# Altium schematic sheet PA-HF_100W-VHF_60W.SchDoc
size A4; SheetNumber: 1; SheetTotal: 5
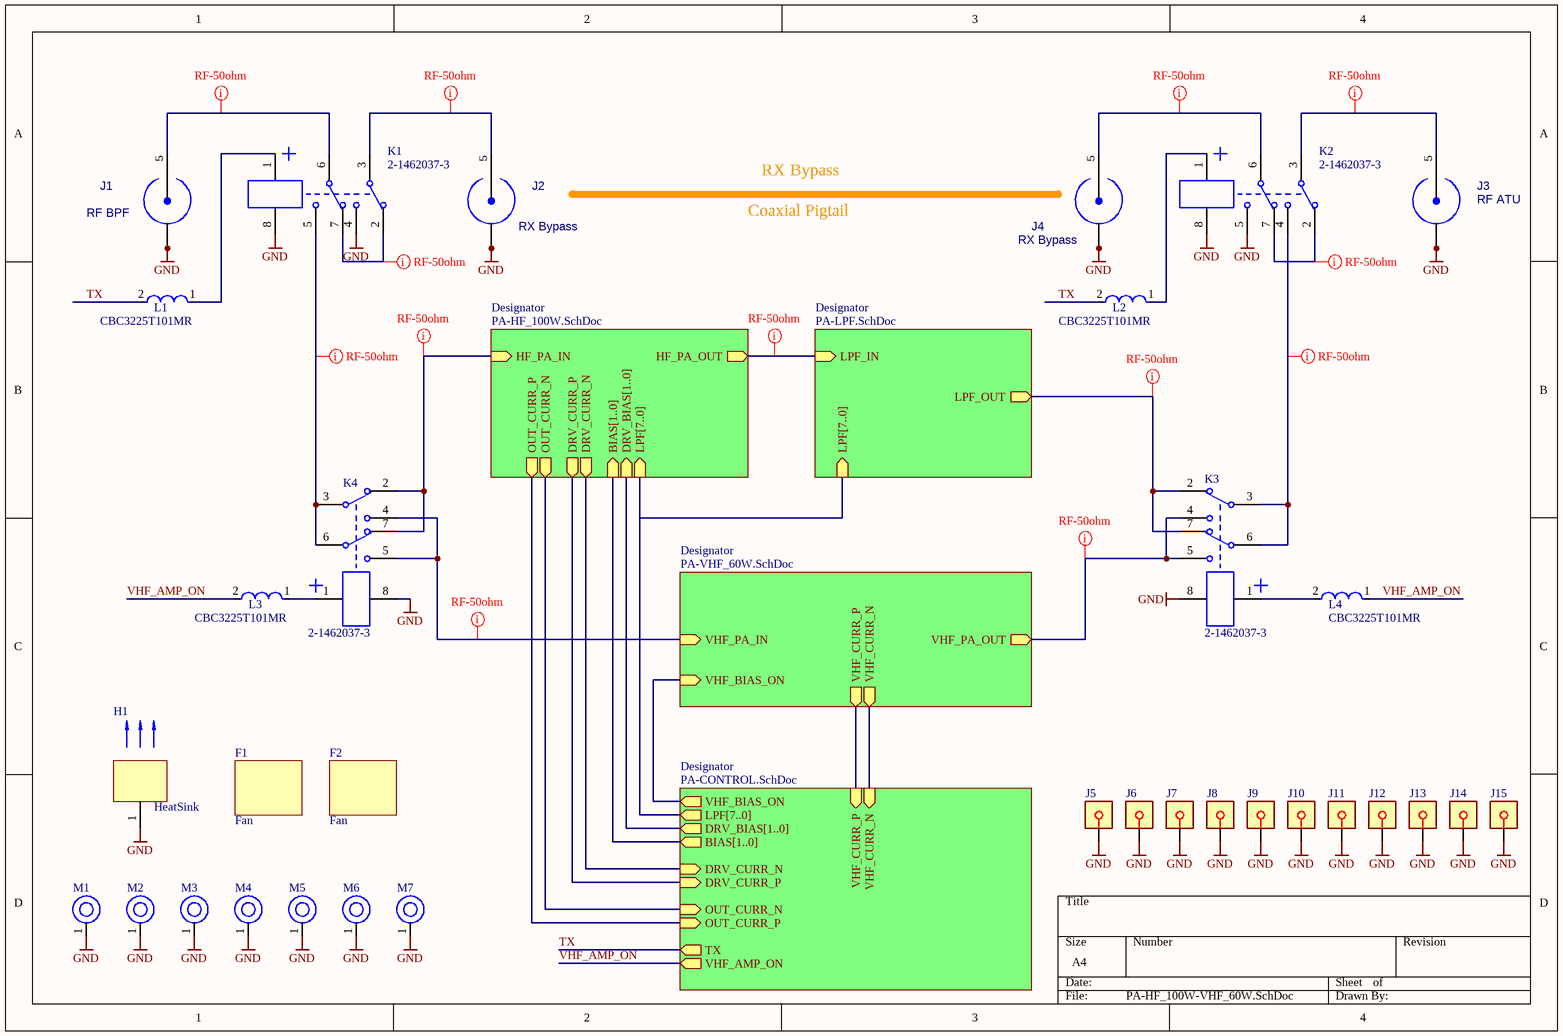
[diagram p0: PA-HF_100W-VHF_60W.SchDoc]

## Parts
F1  Fan  [Fan_60x60x25mm]
F2  Fan  [Fan_60x60x25mm]
H1  HeatSink  [HEATSINK_145x140x35]
J1  RF BPF  [31-5431]
J2  RX Bypass  [31-5431]
J3  RF ATU  [31-5431]
J4  RX Bypass  [31-5431]
J5  SMT RFI Shield Clip  [SMT RFI Shield Clip]  (value not drawn)
J6  SMT RFI Shield Clip  [SMT RFI Shield Clip]  (value not drawn)
J7  SMT RFI Shield Clip  [SMT RFI Shield Clip]  (value not drawn)
J8  SMT RFI Shield Clip  [SMT RFI Shield Clip]  (value not drawn)
J9  SMT RFI Shield Clip  [SMT RFI Shield Clip]  (value not drawn)
J10  SMT RFI Shield Clip  [SMT RFI Shield Clip]  (value not drawn)
J11  SMT RFI Shield Clip  [SMT RFI Shield Clip]  (value not drawn)
J12  SMT RFI Shield Clip  [SMT RFI Shield Clip]  (value not drawn)
J13  SMT RFI Shield Clip  [SMT RFI Shield Clip]  (value not drawn)
J14  SMT RFI Shield Clip  [SMT RFI Shield Clip]  (value not drawn)
J15  SMT RFI Shield Clip  [SMT RFI Shield Clip]  (value not drawn)
K1  2-1462037-3  [TECO-2-1462037-3_V]
K2  2-1462037-3  [TECO-2-1462037-3_V]
K3  2-1462037-3  [TECO-2-1462037-3_V]
K4  2-1462037-3  [TECO-2-1462037-3_V]
L1  CBC3225T101MR  [FP-CB3225-MFG]
L2  CBC3225T101MR  [FP-CB3225-MFG]
L3  CBC3225T101MR  [FP-CB3225-MFG]
L4  CBC3225T101MR  [FP-CB3225-MFG]
M1  MountHole  [MountHole]  (value not drawn)
M2  MountHole  [MountHole]  (value not drawn)
M3  MountHole  [MountHole]  (value not drawn)
M4  MountHole  [MountHole]  (value not drawn)
M5  MountHole  [MountHole]  (value not drawn)
M6  MountHole  [MountHole]  (value not drawn)
M7  MountHole  [MountHole]  (value not drawn)

## Sub-sheets
Designator = PA-CONTROL.SchDoc: LPF[7..0] (out), DRV_BIAS[1..0] (out), BIAS[1..0] (out), DRV_CURR_N (in), DRV_CURR_P (in), OUT_CURR_N (in), OUT_CURR_P (in), VHF_BIAS_ON (out), TX (out), VHF_AMP_ON (out), VHF_CURR_P (in), VHF_CURR_N (in)
Designator = PA-HF_100W.SchDoc: HF_PA_IN (in), HF_PA_OUT (out), DRV_BIAS[1..0] (in), BIAS[1..0] (in), DRV_CURR_N (out), DRV_CURR_P (out), OUT_CURR_N (out), OUT_CURR_P (out), LPF[7..0] (in)
Designator = PA-LPF.SchDoc: LPF_OUT (out), LPF_IN (in), LPF[7..0] (in)
Designator = PA-VHF_60W.SchDoc: VHF_PA_IN (in), VHF_PA_OUT (out), VHF_BIAS_ON (in), VHF_CURR_P (out), VHF_CURR_N (out)

## Nets
GND: H1.1 J1.1(GND) J1.2(GND) J1.3(GND) J1.4(GND) J2.1(GND) J2.2(GND) J2.3(GND) J2.4(GND) J3.1(GND) J3.2(GND) J3.3(GND) J3.4(GND) J4.1(GND) J4.2(GND) J4.3(GND) J4.4(GND) J5.1 J6.1 J7.1 J8.1 J9.1 J10.1 J11.1 J12.1 J13.1 J14.1 J15.1 K1.4 K1.8 K2.5 K2.8 K3.8 K4.8 M1.1 M2.1 M3.1 M4.1 M5.1 M6.1 M7.1
TX: L1.2 L2.2 ; sheet Designator/TX
VHF_AMP_ON: L3.2 L4.1 ; sheet Designator/VHF_AMP_ON
NetJ1_5: J1.5(CON) K1.6
NetJ2_5: J2.5(CON) K1.3
NetJ3_5: J3.5(CON) K2.3
NetJ4_5: J4.5(CON) K2.6
NetK1_1: K1.1 L1.1
NetK1_2: K1.2 K1.7
NetK1_5: K1.5 K4.3 K4.6
NetK2_1: K2.1 L2.1
NetK2_2: K2.2 K2.7
NetK2_4: K2.4 K3.3 K3.6
NetK3_1: K3.1 L4.2
NetK3_2: K3.2 K3.7 ; sheet Designator/LPF_OUT
NetK3_4: K3.4 K3.5 ; sheet Designator/VHF_PA_OUT
NetK4_1: K4.1 L3.1
NetK4_2: K4.2 K4.7 ; sheet Designator/HF_PA_IN
NetK4_4: K4.4 K4.5 ; sheet Designator/VHF_PA_IN
(unnamed): sheet Designator/DRV_CURR_N, sheet Designator/DRV_CURR_N
(unnamed): sheet Designator/DRV_CURR_P, sheet Designator/DRV_CURR_P
(unnamed): sheet Designator/OUT_CURR_N, sheet Designator/OUT_CURR_N
(unnamed): sheet Designator/OUT_CURR_P, sheet Designator/OUT_CURR_P
(unnamed): sheet Designator/VHF_BIAS_ON, sheet Designator/VHF_BIAS_ON
(unnamed): sheet Designator/VHF_CURR_P, sheet Designator/VHF_CURR_P
(unnamed): sheet Designator/VHF_CURR_N, sheet Designator/VHF_CURR_N
(unnamed): sheet Designator/HF_PA_OUT, sheet Designator/LPF_IN

## Layout directives
rule Width Constraint [Pref Impedance = 50,00ohms    Min Impedance = 50,00ohms    Max Impedance = 50,00ohms]: (no net found under the mark), NetJ1_5, NetJ2_5, NetJ3_5, NetJ4_5, NetK1_2, NetK1_5, NetK2_2, NetK2_4, NetK3_2, NetK3_4, NetK4_2, NetK4_4

## Notes on the sheet
- RX Bypass
- Coaxial Pigtail

## Library data of the parts
J1-J4 = 31-5431: SMA
K1-K4 = CMP-2000-05409-1: Signal Relay, 2 A, 12 VDC, -40 to 85 degC, 8-Pin SMD, RoHS, Tape and Reel; Manufacturer: TE Connectivity; Coil Suppression Diode: No; Contact Arrangement: DPDT; Product Length (mm): 10mm; Product Height (mm): 5.65mm; Coil Voltage DC: 12V; Pick-up Voltage (Max): 9VDC; Coil Resistance: 1.029kohm; Voltage Rating (VDC): 220; Dropout Volt: 1.2VDC; Operate Time: 1ms; Contact Current Rating: 2A; Relay Construction: Non-Latching; Seal: Unsealed; Maximum Power Rating: 60W/62.5VA; Product Depth (mm): 7.5mm; Coil Current: 11.67mA; Voltage Rating (VAC): 250V; Contact Form: 2FormC; Contact Material: PalladiumRuthenium/Gold; Pin Count: 8; LED Indicator: No; Operating Temp Range: -40Cto85C; Push To Test Button: No; Mounting Style: SurfaceMount; Type: SignalRelay; Packaging: TapeandReel; Datasheet Version: Rev. 0116, 01/2016; Manufacturer URL: http://www.te.com/; Datasheet URL: http://www.te.com/commerce/DocumentDelivery/DDEController?Action=srchrtrv&DocNm=108-98001&DocType=SS&DocLang=EN; Termination Style: GullWing
L1-L4 = CMP-14484-000373-1: SMD Inductors 100uH ±20% 0.34A 1.82Ω 1210; Resistance: 1.4R; DC Current: 340mA; DC Resistance (DCR): 1.82R; Saturation Current: 270mA; Self Resonant Frequency: 6MHz; Core Material: Ferrite; Inductor Type: POWER; Shielding: Unshielded; Test Frequency: 100kHz; Max Operating Temperature: 105°C; Length: 0.126inch; Inductance: 100uH; Current Rating: 340mA; Resistor Type: Wirewound; Halogen Free: Halogen Free; Height - Seated (Max): 0.106inch; Case/Package: 1210; Package Quantity: 1000; Lead Free: Lead Free; Series: CB; Tolerance: 20%; Depth: 2.7mm; Number of Pins: 2; Width: 0.098inch; Termination: SMD/SMT; Min Operating Temperature: -40°C; Max DC Current: 340mA; Inductance Tolerance: 20%; Radiation Hardening: No; Military Standard: Not; Height: 2.5mm; Case Code (Metric): 3225; Packaging: Tape and Reel; Mount: Surface Mount; RoHS Compliant: Yes; Case Code (Imperial): 1210